# Altium schematic sheet LowPassFilter.SchDoc: Low Pass Filter
size A4; DrawnBy: Patrik Staudenmayer; DocumentNumber: 12; SheetNumber: 12; SheetTotal: 15
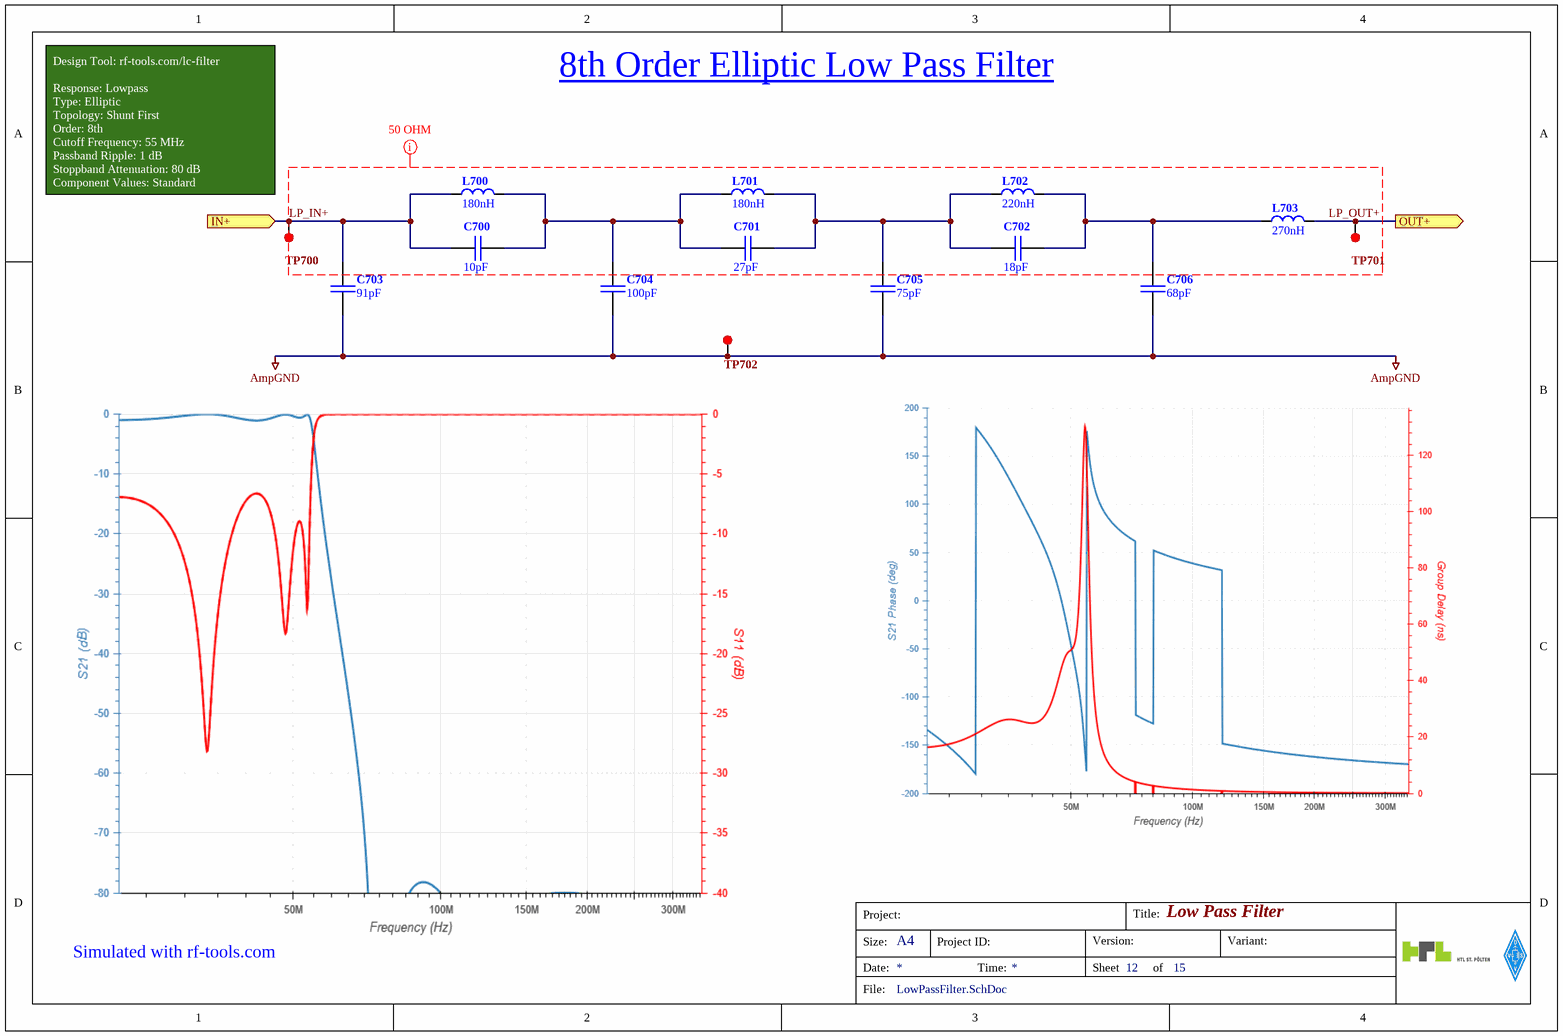
[diagram p0: LowPassFilter.SchDoc]

## Parts
C700  10pF  [C_0603_N [CAPC1608N IPC]]
C701  27pF  [C_0603_N [CAPC1608N IPC]]
C702  18pF  [C_0603_N [CAPC1608N IPC]]
C703  91pF  [C_0603_N [CAPC1608N IPC]]
C704  100pF  [C_0603_N [CAPC1608N IPC]]
C705  75pF  [C_0603_N [CAPC1608N IPC]]
C706  68pF  [C_0603_N [CAPC1608N IPC]]
L700  180nH  [L_0603_N [INDC1608N IPC]]
L701  180nH  [L_0603_N [INDC1608N IPC]]
L702  220nH  [L_0603_N [INDC1608N IPC]]
L703  270nH  [L_0603_N [INDC1608N IPC]]
TP700  TP_GENERIC  [TP_0.8_P100T]  (value not drawn)  (no BOM)
TP701  TP_GENERIC  [TP_0.8_P100T]  (value not drawn)  (no BOM)
TP702  TP_GENERIC  [TP_0.8_P100T]  (value not drawn)  (no BOM)

## Ports
IN+ (in), OUT+ (out)

## Nets
AmpGND: C703.1 C704.1 C705.1 C706.1 TP702.1
LP_IN+: C700.1 C703.2 L700.1 TP700.1 ; port IN+
LP_OUT+: L703.2 TP701.1 ; port OUT+
NetC700_2: C700.2 C701.1 C704.2 L700.2 L701.1
NetC701_2: C701.2 C702.1 C705.2 L701.2 L702.1
NetC702_2: C702.2 C706.2 L702.2 L703.1

## Layout directives
net class Filter; rule Width Constraint [Pref Impedance = 50.00ohms    Min Impedance = 50.00ohms    Max Impedance = 50.00ohms]: LP_IN+, LP_OUT+

## Notes on the sheet
- 8th Order Elliptic Low Pass Filter
- (near TP700) Design Tool: rf-tools.com/lc-filter
  Response: Lowpass
  Type: Elliptic
  Topology: Shunt First
  Order: 8th
  Cutoff Frequency: 55 MHz
  Passband Ripple: 1 dB
  Stoppband Attenuation: 80 dB
  Component Values: Standard
- Simulated with rf-tools.com
- Project:
- Title:
- Size:
- Date:
- A4
- Project ID:
- Time:
- Sheet
- Version:
- of
- Variant:
- File:

## Library data of the parts
C700 = C_GENERIC: Prometheus_Manufacturer: AVX Corporation; Prometheus_ID: 06031U100FAT2A; Prometheus_ManPartNo: 10pF; Prometheus_Comment: 10pF; Prometheus_CurrentFootprint: C_0603_N [CAPC1608N IPC]
C701 = C_GENERIC: Prometheus_Manufacturer: AVX Corporation; Prometheus_ID: 06031U270FAT2A; Prometheus_ManPartNo: 27pF; Prometheus_Comment: 27pF; Prometheus_CurrentFootprint: C_0603_N [CAPC1608N IPC]
C702 = C_GENERIC: Prometheus_Manufacturer: AVX Corporation; Prometheus_ID: 06031U180FAT2A; Prometheus_ManPartNo: 18pF; Prometheus_Comment: 18pF; Prometheus_CurrentFootprint: C_0603_N [CAPC1608N IPC]
C703 = C_GENERIC: Prometheus_Manufacturer: AVX Corporation; Prometheus_ID: 06031U910FAT2A; Prometheus_ManPartNo: 91pF; Prometheus_Comment: 91pF; Prometheus_CurrentFootprint: C_0603_N [CAPC1608N IPC]
C704 = C_GENERIC: Prometheus_Manufacturer: AVX Corporation; Prometheus_ID: 06031U101FAT2A; Prometheus_ManPartNo: 100pF; Prometheus_Comment: 100pF; Prometheus_CurrentFootprint: C_0603_N [CAPC1608N IPC]
C705 = C_GENERIC: Prometheus_Manufacturer: AVX Corporation; Prometheus_ID: 06031U750FAT2A; Prometheus_ManPartNo: 75pF; Prometheus_Comment: 75pF; Prometheus_CurrentFootprint: C_0603_N [CAPC1608N IPC]
C706 = C_GENERIC: Prometheus_Manufacturer: AVX Corporation; Prometheus_ID: 06031U680FAT2A; Prometheus_ManPartNo: 68pF; Prometheus_Comment: 68pF; Prometheus_CurrentFootprint: C_0603_N [CAPC1608N IPC]
L700 L701 = L_GENERIC: Prometheus_ManPartNo: 744761218C; Prometheus_Manufacturer: Wuerth Electronics; Prometheus_ID: *; Prometheus_Comment: 180nH; Prometheus_CurrentFootprint: L_0603_N [INDC1608N IPC]
L702 = L_GENERIC: Prometheus_ManPartNo: 744761222C; Prometheus_Manufacturer: Wuerth Electronics; Prometheus_ID: *; Prometheus_Comment: 220nH; Prometheus_CurrentFootprint: L_0603_N [INDC1608N IPC]
L703 = L_GENERIC: Prometheus_ManPartNo: 744761227C; Prometheus_Manufacturer: Wuerth Electronics; Prometheus_ID: *; Prometheus_Comment: 270nH; Prometheus_CurrentFootprint: L_0603_N [INDC1608N IPC]
TP700-TP702 = TP_GENERIC: Needle Test Point; Prometheus_ID: *; Prometheus_ManPartNo: TP_GENERIC; Prometheus_Manufacturer: *; Prometheus_Comment: TP_GENERIC; Prometheus_CurrentFootprint: TP_0.8_P100T